# Altium schematic sheet OpenBLC_CONNECTIONS.SchDoc
size A
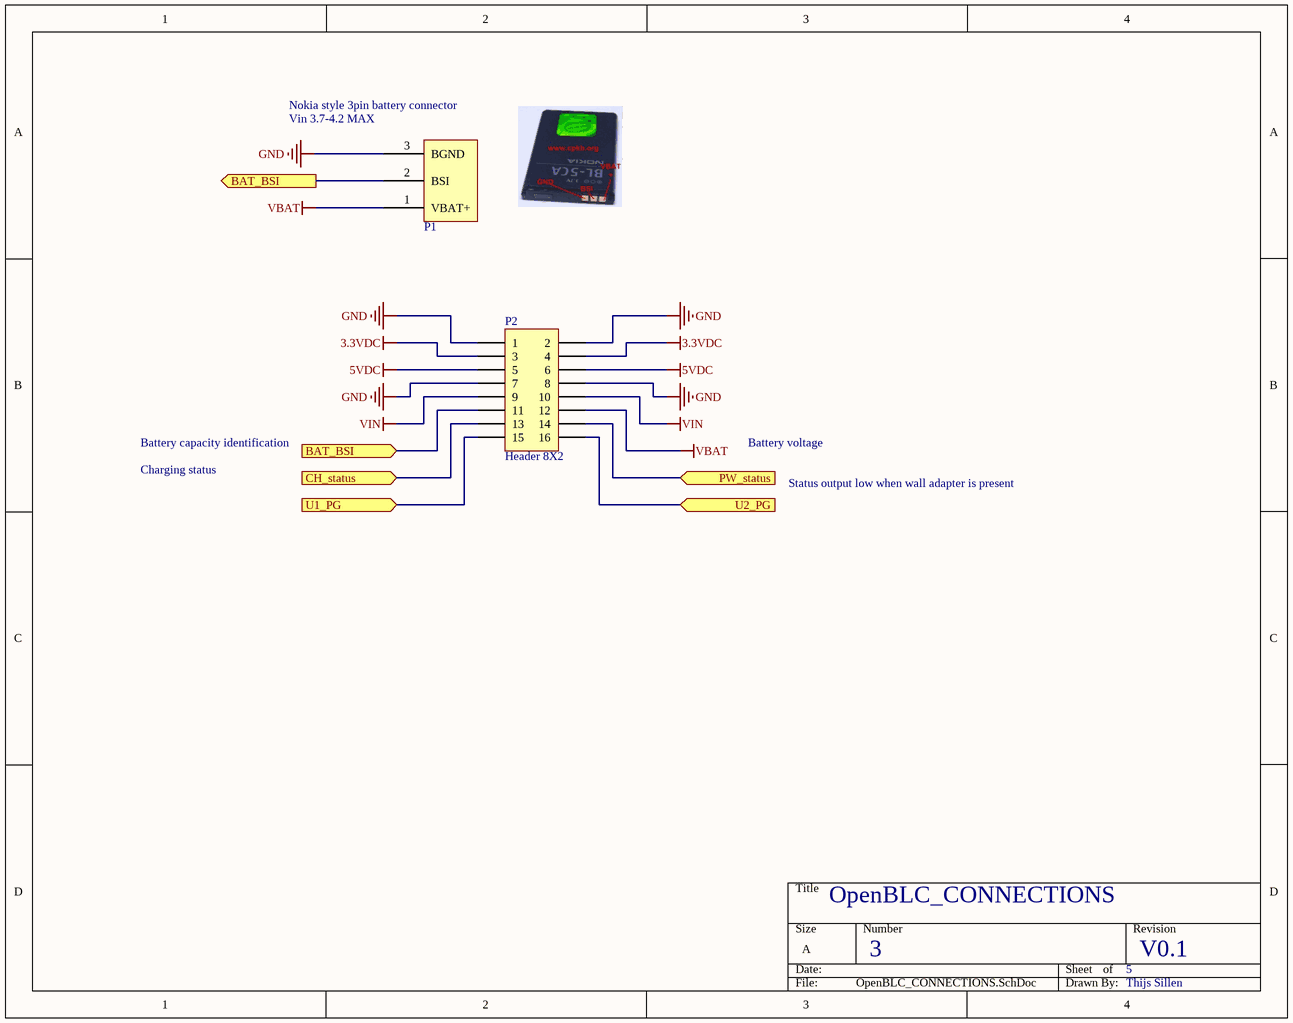
[diagram p0: OpenBLC_CONNECTIONS.SchDoc]

## Parts
P1  Nokia 3pin pogo connector  [Nokia_3P_batt_conn]  (value not drawn)
P2  Header 8X2  [HDR2X8]

## Ports
BAT_BSI (in), BAT_BSI (out), CH_status (in), PW_status (in), U1_PG (in), U2_PG (in)

## Nets
3.3VDC: P2.3 P2.4
5VDC: P2.5 P2.6
GND: P1.3(BGND) P2.1 P2.2 P2.7 P2.8
VBAT: P1.1(VBAT+) P2.12
VIN: P2.9 P2.10
BAT_BSI: P1.2(BSI) P2.11 ; port BAT_BSI
CH_status: P2.13 ; port CH_status
PW_status: P2.14 ; port PW_status
U1_PG: P2.15 ; port U1_PG
U2_PG: P2.16 ; port U2_PG

## Notes on the sheet
- (near P1) Nokia style 3pin battery connector
- (near P1) Vin 3.7-4.2 MAX
- Battery capacity identification
- Charging status
- Battery voltage
- Status output low when wall adapter is present
- OpenBLC_CONNECTIONS
- 3
- 5
- V0.1
- Thijs Sillen

## Library data of the parts
P1 = Nokia_3PIN_BATT_CONTACT
P2 = Header 8X2: Header, 8-Pin, Dual row; LatestRevisionDate: 17-Jul-2002; LatestRevisionNote: Re-released for DXP Platform.; Publisher: Altium Limited